# Altium schematic sheet MUX.SchDoc
size 406 x 304 mm; SheetNumber: 8; SheetTotal: 18
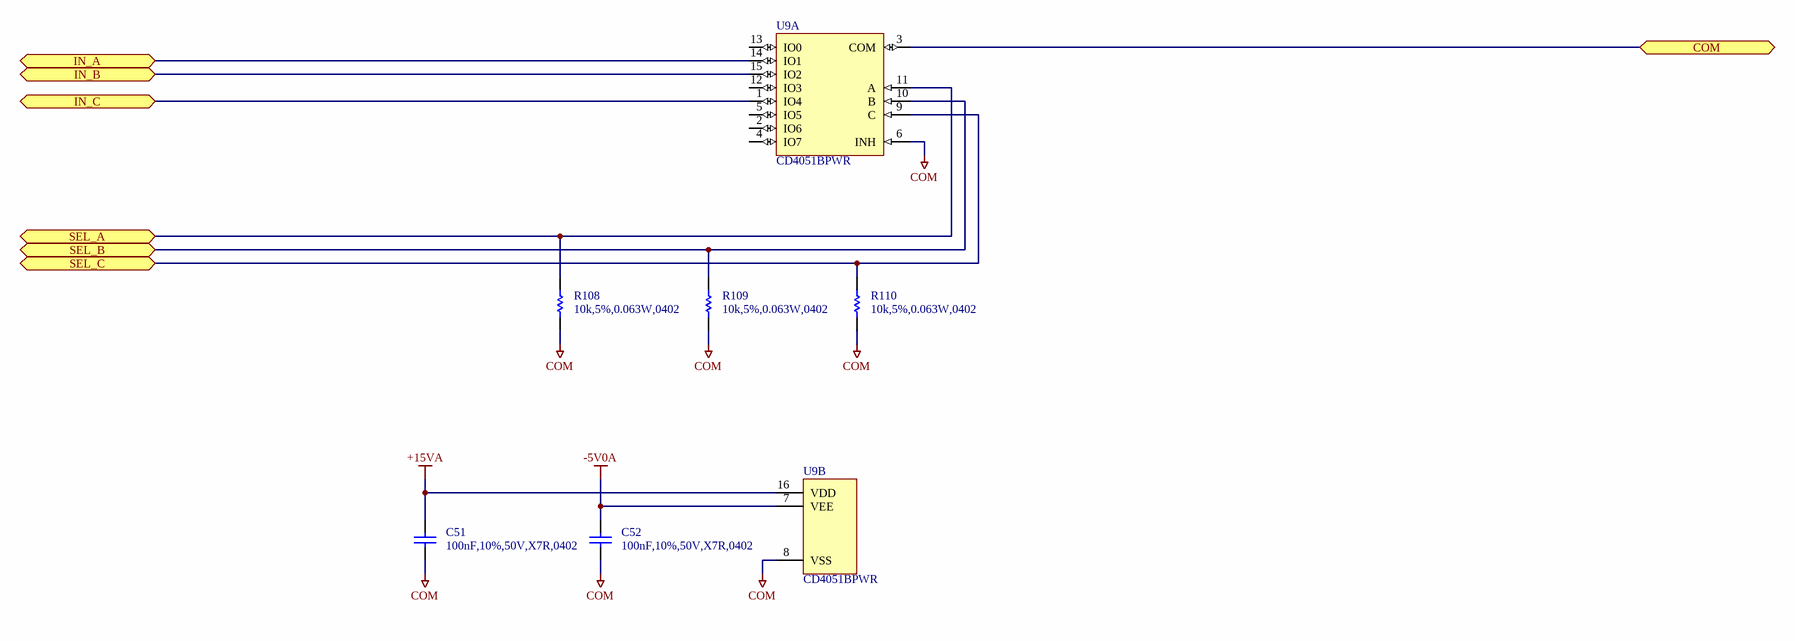
[diagram p0: MUX.SchDoc]

## Parts
C51  100nF,10%,50V,X7R,0402  [CAPC1005X06N]
C52  100nF,10%,50V,X7R,0402  [CAPC1005X06N]
R108  10k,5%,0.063W,0402  [RESC1005X04N]
R109  10k,5%,0.063W,0402  [RESC1005X04N]
R110  10k,5%,0.063W,0402  [RESC1005X04N]
U9  CD4051BPWR  [TEXASINSTRUMENTS_PKG_PW0016A]  (parts A,B of 2)

## Ports
COM (bidir), IN_A (bidir), IN_B (bidir), IN_C (bidir), SEL_A (bidir), SEL_B (bidir), SEL_C (bidir)

## Nets
+15VA: C51.2 U9.16(VDD)
-5V0A: C52.2 U9.7(VEE)
COM: C51.1 C52.1 R108.1 R109.1 R110.1 U9.6(INH) U9.8(VSS)
COM: U9.3(COM) ; port COM  [a separate net that carries the same name]
IN_A: U9.14(IO1) ; port IN_A
IN_B: U9.15(IO2) ; port IN_B
IN_C: U9.1(IO4) ; port IN_C
SEL_A: R108.2 U9.11(A) ; port SEL_A
SEL_B: R109.2 U9.10(B) ; port SEL_B
SEL_C: R110.2 U9.9(C) ; port SEL_C

Not connected (* = marked no-connect by the designer): U9 2(IO6) 4(IO7) 5(IO5) 12(IO3) 13(IO0)

## Notes on the sheet
- Rev
- Sheet Name:
- Date:
- Sheet
- Designer:
- of

## Library data of the parts
C51 C52 = CAP,Cer,100nF,10%,50V,X7R,0402: 50V 100nF X7R Â±10% 0402 Ceramic Capacitors ROHS; Manufacturer 1: Murata; Manufacturer 1 Part Number: GRM155R71H104KE14D; Vendor 1 Part Number: C77020; Vendor 1: LCSC; Value: 100n; Part Name: CAP,Cer,100nF,10%,50V,X7R,0402; CreatedBy: Judd Foster; HelpURL: https://www.lcsc.com/datasheet/C77020.pdf
R108-R110 = RES,10k,5%,0.063W,0402: 10 kOhms ï¿½5% 0.063W, 1/16W Chip Resistor 0402 (1005 Metric) Automotive AEC-Q200 Thick Film; Manufacturer 1: Stackpole Electronics Inc; Manufacturer 1 Part Number: RMCF0402JT10K0; Vendor 1 Part Number: RMCF0402JT10K0CT-ND; Vendor 1: DIgikey; Part Name: RES,10k,5%,0.063W,0402; CreatedBy: Judd Foster; HelpURL: https://www.seielect.com/catalog/sei-rmcf_rmcp.pdf; Value: 10k
U9 = CD4051BPWR: 1 125Î© 8:1 TSSOP-16 Analog Switches, Multiplexers, Demultiplexers ROHS; Manufacturer 1: Texas Instruments; Vendor 1 Part Number: C54587; Vendor 1: LCSC; Part Name: CD4051BPWR; CreatedBy: Judd Foster; HelpURL: https://www.lcsc.com/datasheet/C54587.pdf; Manufacturer 1 Part Number: CD4051BPWR